# EAGLE design ahe_v1_0 (EAGLE 9.6.2)
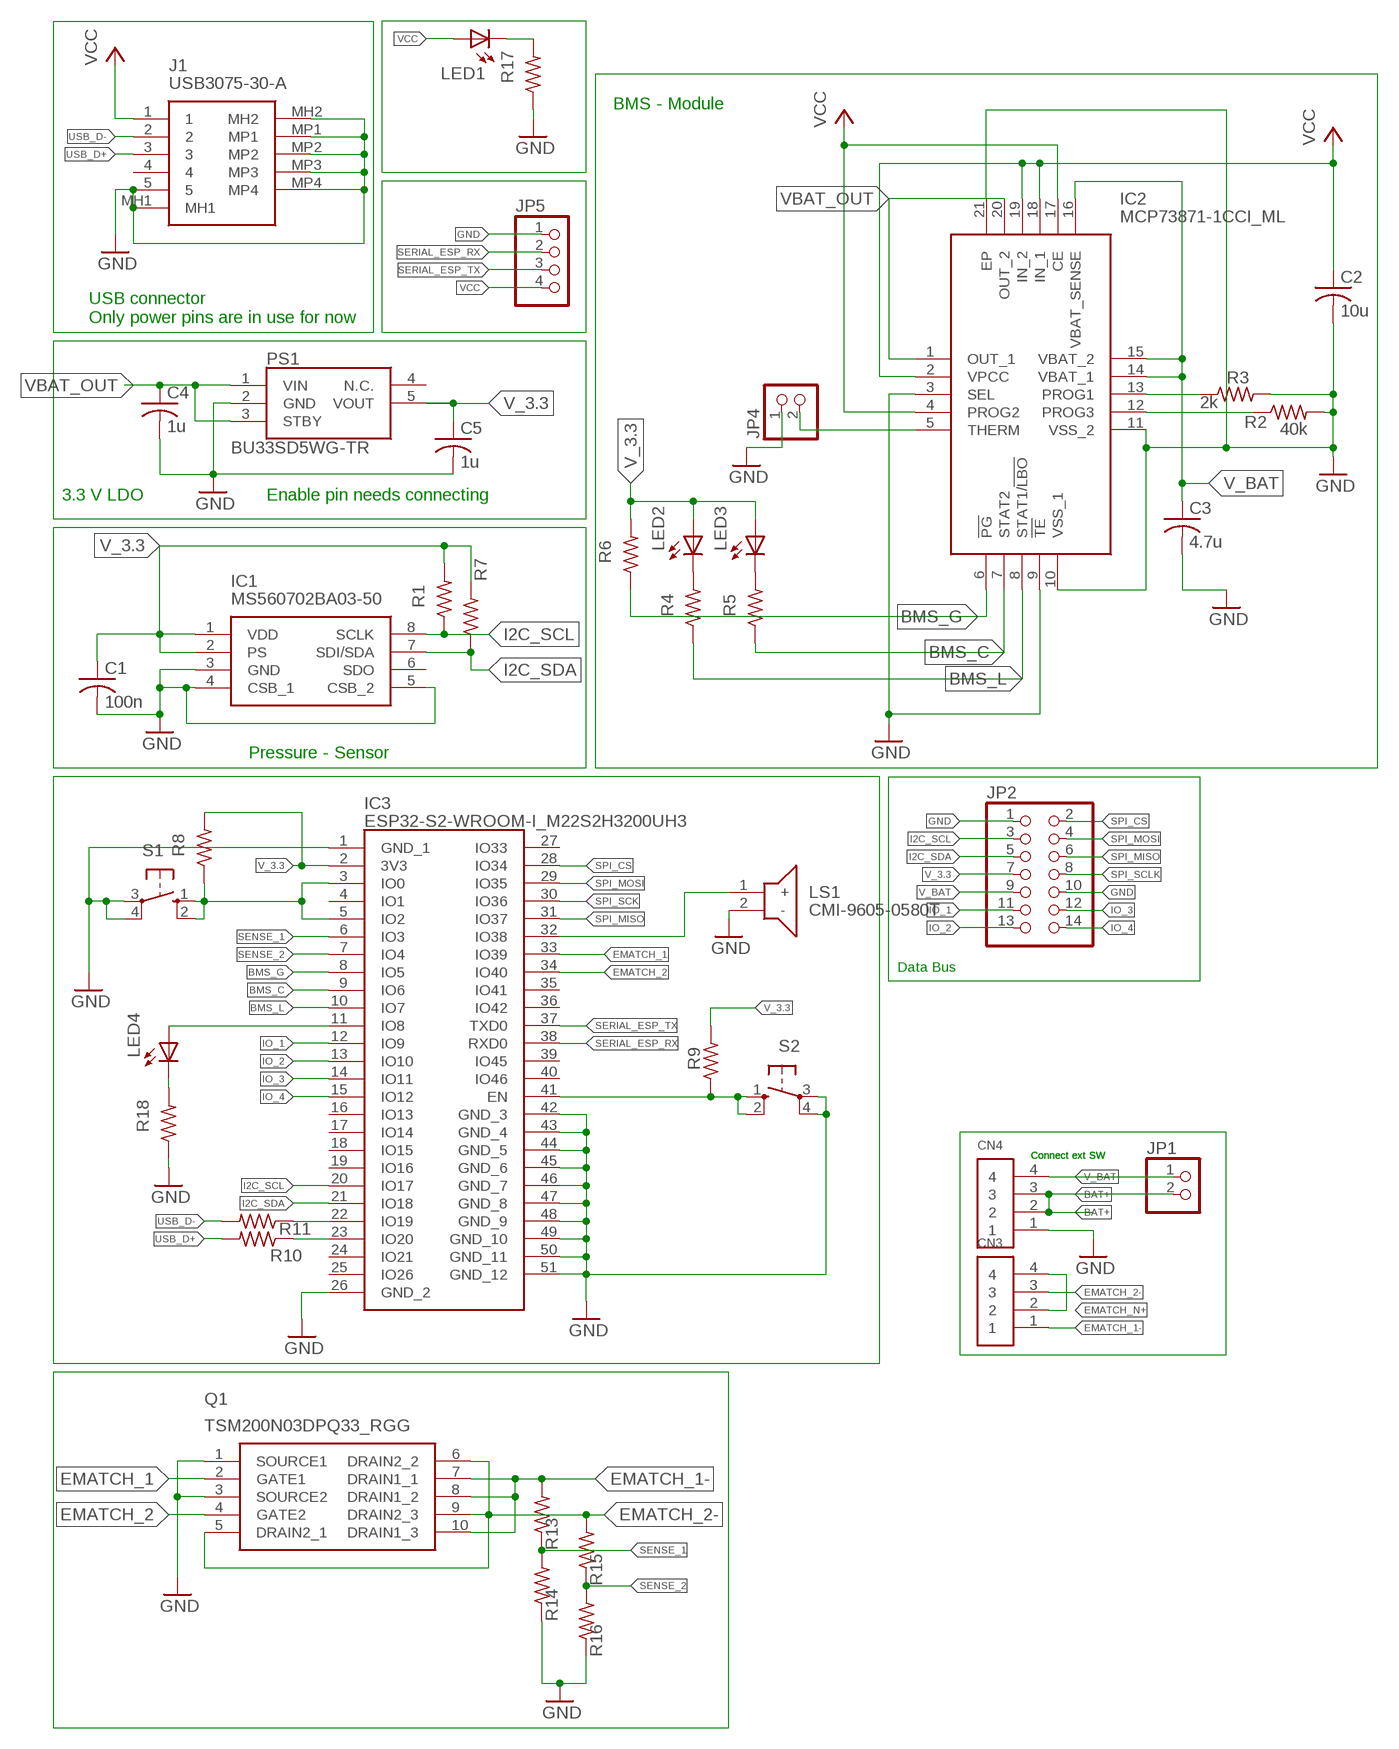
[diagram p0: schematic, sheet 1]

## Parts
C1  100n  C-USC0805  [C0805]
C2  10u  C-USC0805  [C0805]
C3  4.7u  C-USC0805  [C0805]
C4  1u  C-USC0805  [C0805]
C5  1u  C-USC0805  [C0805]
CN3  1X4-3.5MM  [1X04-3.5MM]
CN4  1X4-3.5MM  [1X04-3.5MM]
IC1  MS560702BA03-50  [MS5607-02BA03]
IC2  MCP73871-1CCI_ML  [QFN50P400X400X100-21N]
IC3  ESP32-S2-WROOM-I_M22S2H3200UH3  [ESP32S2WROOMIM22S2H3200UH3Q0]
J1  USB3075-30-A  [USB307530A]
JP1  PINHD-1X2  [1X02]
JP2  PINHD-2X7  [2X07]
JP4  PINHD-1X2  [1X02]
JP5  PINHD-1X4  [1X04]
LED1  LEDCHIPLED_0805  [CHIPLED_0805]
LED2  LEDCHIPLED_0805  [CHIPLED_0805]
LED3  LEDCHIPLED_0805  [CHIPLED_0805]
LED4  LEDCHIPLED_0805  [CHIPLED_0805]
LS1  CMI-9605-0580T  [CMI96050580T]
PS1  BU33SD5WG-TR  [SOT95P280X125-5N]
Q1  TSM200N03DPQ33_RGG  [TSM200N03DPQ33RGG]
R1  10k  R-US_R0805  [R0805]
R2  40k  R-US_R0805  [R0805]
R3  2k  R-US_R0805  [R0805]
R4  330  R-US_R0805  [R0805]
R5  330  R-US_R0805  [R0805]
R6  10k  R-US_R0805  [R0805]
R7  10k  R-US_R0805  [R0805]
R8  10k  R-US_R0805  [R0805]
R9  10k  R-US_R0805  [R0805]
R10  33  R-US_R0805  [R0805]
R11  33  R-US_R0805  [R0805]
R13  100k  R-US_R0805  [R0805]
R14  27k  R-US_R0805  [R0805]
R15  100k  R-US_R0805  [R0805]
R16  27k  R-US_R0805  [R0805]
R17  330  R-US_R0805  [R0805]
R18  330  R-US_R0805  [R0805]
S1  10-XX  [B3F-10XX]
S2  10-XX  [B3F-10XX]

## Nets
BAT+ [PWR]: CN4.2 CN4.3 JP1.2
BMS_C: IC2.7(STAT2) IC3.9(IO6) R5.1
BMS_G: IC2.6(!PG) IC3.8(IO5) R6.1
BMS_L: IC2.8(STAT1/!LBO) IC3.10(IO7) R4.1
EMATCH_1: IC3.33(IO39) Q1.2(GATE1)
EMATCH_1- [PWR]: CN3.1 Q1.7(DRAIN1_1) Q1.8(DRAIN1_2) Q1.10(DRAIN1_3) R13.2
EMATCH_2: IC3.34(IO40) Q1.4(GATE2)
EMATCH_2- [V_bat]: CN3.3 Q1.5(DRAIN2_1) Q1.6(DRAIN2_2) Q1.9(DRAIN2_3) R15.2
EMATCH_N+ [PWR]: CN3.2 CN3.4
GND [V_bat]: C1.2 C2.2 C3.2 C4.2 C5.2 CN4.1 IC1.3(GND) IC1.4(CSB_1) IC1.5(CSB_2) IC2.3(SEL) IC2.9(!TE) IC2.10(VSS_1) IC2.11(VSS_2) IC2.21(EP) IC3.1(GND_1) IC3.26(GND_2) IC3.42(GND_3) IC3.43(GND_4) IC3.44(GND_5) IC3.45(GND_6) IC3.46(GND_7) IC3.47(GND_8) IC3.48(GND_9) IC3.49(GND_10) IC3.50(GND_11) IC3.51(GND_12) J1.5 J1.MH1 J1.MH2 J1.MP1 J1.MP2 J1.MP3 J1.MP4 JP2.1 JP2.10 JP4.1 JP5.1 LS1.2(-) PS1.2(GND) Q1.1(SOURCE1) Q1.3(SOURCE2) R2.2 R3.2 R14.1 R16.1 R17.1 R18.1 S1.3(P) S1.4(P1) S2.3(P) S2.4(P1)
I2C_SCL: IC1.8(SCLK) IC3.20(IO17) JP2.3 R1.1
I2C_SDA: IC1.7(SDI/SDA) IC3.21(IO18) JP2.5 R7.1
IO_1: IC3.12(IO9) JP2.11
IO_2: IC3.13(IO10) JP2.13
IO_3: IC3.14(IO11) JP2.12
IO_4: IC3.15(IO12) JP2.14
N$1: IC2.13(PROG1) R3.1
N$2: IC2.12(PROG3) R2.1
N$3: IC2.5(THERM) JP4.2
N$10: IC3.3(IO0) IC3.5(IO2) R8.1 S1.1(S) S1.2(S1)
N$14: IC3.22(IO19) R11.1
N$15: IC3.23(IO20) R10.1
N$18: LED1.C R17.2
N$20: LED2.C R4.2
N$21: LED3.C R5.2
N$22: LED4.C R18.2
N$23: IC3.11(IO8) LED4.A
N$24: IC3.41(EN) R9.1 S2.1(S) S2.2(S1)
SENSE_1: IC3.6(IO3) R13.1 R14.2
SENSE_2: IC3.7(IO4) R15.1 R16.2
SERIAL_ESP_RX: IC3.38(RXD0) JP5.2
SERIAL_ESP_TX: IC3.37(TXD0) JP5.3
SOUND: IC3.32(IO38) LS1.1(+)
SPI_CS: IC3.28(IO34) JP2.2
SPI_MISO: IC3.31(IO37) JP2.6
SPI_MOSI: IC3.29(IO35) JP2.4
SPI_SCK: IC3.30(IO36)
SPI_SCLK: JP2.8
USB_D+: J1.3 R10.2
USB_D-: J1.2 R11.2
V_3.3 [PWR]: C1.1 C5.1 IC1.1(VDD) IC1.2(PS) IC3.2(3V3) JP2.7 LED2.A LED3.A PS1.5(VOUT) R1.2 R6.2 R7.2 R8.2 R9.2
V_BAT [PWR]: C3.1 CN4.4 IC2.14(VBAT_1) IC2.15(VBAT_2) IC2.16(VBAT_SENSE) JP1.1 JP2.9
VBAT_OUT: C4.1 IC2.1(OUT_1) IC2.20(OUT_2) PS1.1(VIN) PS1.3(STBY)
VCC [PWR]: C2.1 IC2.2(VPCC) IC2.4(PROG2) IC2.17(CE) IC2.18(IN_1) IC2.19(IN_2) J1.1 JP5.4 LED1.A
Unconnected: IC1.6(SDO) IC3.4(IO1) IC3.16(IO13) IC3.17(IO14) IC3.18(IO15) IC3.19(IO16) IC3.24(IO21) IC3.25(IO26) IC3.27(IO33) IC3.35(IO41) IC3.36(IO42) IC3.39(IO45) IC3.40(IO46) J1.4 PS1.4(N.C.)

## Notes on the sheet
- BMS - Module
- USB connector
  Only power pins are in use for now
- 3.3 V LDO | Enable pin needs connecting
- Pressure - Sensor
- Data Bus
- Connect ext SW | Connect ext SW | Connect ext SW

## Library data of the parts
C1-C5 = rcl:C-US: CAPACITOR, American symbol; SPICEPREFIX: C
CN3 CN4 = adafruit:1X4: 4-pin connector
IC1 = MS560702BA03-50:MS560702BA03-50: MS560702BA03-50, Barometric Pressure Sensor, 1200mbar 0 3.6 V Output, 8-Pin QFN Source: Datasheet <http://www.te.com/commerce/DocumentDelivery/DDEController?Action=srchrtrv&DocNm=MS5607-02BA03&DocType=Data Sheet&DocLang=English>; DESCRIPTION: MS560702BA03-50, Barometric Pressure Sensor, 1200mbar 0 3.6 V Output, 8-Pin QFN; HEIGHT: mm; MANUFACTURER_NAME: TE Connectivity; MANUFACTURER_PART_NUMBER: MS560702BA03-50; MOUSER_PART_NUMBER: 824-MS560702BA03-50; MOUSER_PRICE-STOCK: https://www.mouser.co.uk/ProductDetail/Measurement-Specialties/MS560702BA03-50?qs=urSpXqmdEVImCZG1H%252BT8ng%3D%3D
IC2 = MCP73871-1CCI_ML:MCP73871-1CCI_ML: Battery Management USB/AC Battery Charger w/Pwr Mgmt Source: Datasheet <https://ww1.microchip.com/downloads/en/DeviceDoc/MCP73871-Data-Sheet-20002090E.pdf>; DESCRIPTION: Battery Management USB/AC Battery Charger w/Pwr Mgmt; HEIGHT: 1mm; MANUFACTURER_NAME: Microchip; MANUFACTURER_PART_NUMBER: MCP73871-1CCI/ML; MOUSER_PART_NUMBER: 579-MCP73871-1CCI/ML; MOUSER_PRICE-STOCK: https://www.mouser.co.uk/ProductDetail/Microchip-Technology-Atmel/MCP73871-1CCI-ML?qs=wd5RIQLrsJhV5aSUuJa0zQ%3D%3D
IC3 = ESP32-S2-WROOM-I_M22S2H3200UH3:ESP32-S2-WROOM-I_M22S2H3200UH3: WiFi Modules (802.11) Module ESP32-S2 WROOM IPEX ANT Source: Datasheet <https://www.espressif.com/sites/default/files/documentation/esp32-s2-wroom_esp32-s2-wroom-i_datasheet_en.pdf>; DESCRIPTION: WiFi Modules (802.11) Module ESP32-S2 WROOM IPEX ANT; HEIGHT: 3.45mm; MANUFACTURER_NAME: Espressif Systems; MANUFACTURER_PART_NUMBER: ESP32-S2-WROOM-I(M22S2H3200UH3Q0); MOUSER_PART_NUMBER: 356-ESP32S2WRMI320UH; MOUSER_PRICE-STOCK: https://www.mouser.co.uk/ProductDetail/Espressif-Systems/ESP32-S2-WROOM-IM22S2H3200UH3Q0?qs=vHuUswq2%252BswK%2FNdFP9puyg%3D%3D
J1 = USB3075-30-A:USB3075-30-A: GCT (GLOBAL CONNECTOR TECHNOLOGY) - USB3075-30-A - USB Connector, Micro USB Type B, USB 2.0, Receptacle, 5 Ways, Surface Mount, Right Angle Source: Datasheet <https://componentsearchengine.com/Datasheets/2/USB3075-30-A.pdf>; DESCRIPTION: GCT (GLOBAL CONNECTOR TECHNOLOGY) - USB3075-30-A - USB Connector, Micro USB Type B, USB 2.0, Receptacle, 5 Ways, Surface Mount, Right Angle; HEIGHT: 2.7mm; MANUFACTURER_NAME: GCT (GLOBAL CONNECTOR TECHNOLOGY); MANUFACTURER_PART_NUMBER: USB3075-30-A; MOUSER_PART_NUMBER: 640-USB3075-30-A; MOUSER_PRICE-STOCK: https://www.mouser.co.uk/ProductDetail/GCT/USB3075-30-A?qs=KUoIvG%2F9IlbGMJplbp1ybA%3D%3D
JP1 JP4 = pinhead:PINHD-1X2: PIN HEADER
JP2 = pinhead:PINHD-2X7: PIN HEADER
JP5 = pinhead:PINHD-1X4: PIN HEADER
LED1-LED4 = adafruit:LED: LED OSRAM: - CHIPLED LG R971, LG N971, LY N971, LG Q971, LY Q971, LO R971, LY R971 LH N974, LH R974 LS Q976, LO Q976, LY Q976 LO Q996 - Hyper CHIPLED LW Q18S LB Q993, LB Q99A, LB R99A - SideLED LS A670, LO A670, LY A670, LG A670, LP A670 LB A673, LV A673, LT A673, LW A673 LH A674 LY A675 LS A676, LA A676, LO A676, LY A676, LW A676 LS A679, LY A679, LG A679 - Hyper Micro SIDELED® LS Y876, LA Y876, LO Y876, LY Y876 LT Y87S - SmartLED LW L88C, LW L88S LB L89C, LB L89S, LG L890 LS L89K, LO L89K, LY L89K LS L896, LA L896, LO L896, LY L896 - TOPLED LS T670, LO T670, LY T670, LG T670, LP T670 LSG T670, LSP T670, LSY T670, LOP T670, LYG T670 LG T671, LOG T671, LSG T671 LB T673, LV T673, LT T673, LW T673 LH T674 LS T676, LA T676, LO T676, LY T676, LB T676, LH T676, LSB T676, LW T676 LB T67C, LV T67C, LT T67C, LS T67K, LO T67K, LY T67K, LW E67C LS E67B, LA E67B, LO E67B, LY E67B, LB E67C, LV E67C, LT E67C LW T67C LS T679, LY T679, LG T679 LS T770, LO T770, LY T770, LG T770, LP T770 LB T773, LV T773, LT T773, LW T773 LH T774 LS E675, LA E675, LY E675, LS T675 LS T776, LA T776, LO T776, LY T776, LB T776 LHGB T686 LT T68C, LB T68C - Hyper Mini TOPLED® LB M676 - Mini TOPLED Santana® LG M470 LS M47K, LO M47K, LY M47K Source: http://www.osram.convergy.de/
LS1 = CMI-9605-0580T:CMI-9605-0580T: Piezo Buzzers & Audio Indicators buzzer, 9.6 mm x 5 mm deep, M, 5 VDC, 80 dB, Through Hole, Audio Indicator Source: Datasheet <https://componentsearchengine.com/Datasheets/1/CMI-9605-0580T.pdf>; DESCRIPTION: Piezo Buzzers & Audio Indicators buzzer, 9.6 mm x 5 mm deep, M, 5 VDC, 80 dB, Through Hole, Audio Indicator; HEIGHT: 5mm; MANUFACTURER_NAME: CUI Inc.; MANUFACTURER_PART_NUMBER: CMI-9605-0580T; MOUSER_PART_NUMBER: 490-CMI-9605-0580T; MOUSER_PRICE-STOCK: https://www.mouser.co.uk/ProductDetail/CUI-Devices/CMI-9605-0580T?qs=P1JMDcb91o49u9Yh70m6sw%3D%3D
PS1 = BU33SD5WG-TR:BU33SD5WG-TR: LDO regulator,3.3V,0.5A,standby,SSOP5 ROHM BU33SD5WG-TR, LDO Voltage Regulator, 0.5A, 3.3 V +/-2%, 1.7 6 Vin, 5-Pin SSOP Source: Datasheet <https://componentsearchengine.com/Datasheets/1/BU33SD5WG-TR.pdf>; DESCRIPTION: LDO regulator,3.3V,0.5A,standby,SSOP5 ROHM BU33SD5WG-TR, LDO Voltage Regulator, 0.5A, 3.3 V +/-2%, 1.7 6 Vin, 5-Pin SSOP; HEIGHT: 1.25mm; MANUFACTURER_NAME: ROHM Semiconductor; MANUFACTURER_PART_NUMBER: BU33SD5WG-TR; MOUSER_PART_NUMBER: 755-BU33SD5WG-TR; MOUSER_PRICE-STOCK: https://www.mouser.co.uk/ProductDetail/ROHM-Semiconductor/BU33SD5WG-TR?qs=%2FKR40Cd6GUrQDzRkUEt69Q%3D%3D
Q1 = TSM200N03DPQ33_RGG:TSM200N03DPQ33_RGG: MOSFET MOSFET, Dual, N-Ch Trench, 30V, 20A Source: Datasheet <https://www.taiwansemi.com/products/datasheet/TSM200N03D_B1710.pdf>; DESCRIPTION: MOSFET MOSFET, Dual, N-Ch Trench, 30V, 20A; HEIGHT: 0.8mm; MANUFACTURER_NAME: Taiwan Semiconductor; MANUFACTURER_PART_NUMBER: TSM200N03DPQ33 RGG; MOUSER_PART_NUMBER: 821-TSM200N03DPQ33RG; MOUSER_PRICE-STOCK: https://www.mouser.co.uk/ProductDetail/Taiwan-Semiconductor/TSM200N03DPQ33-RGG?qs=BZBei1rCqCAHGBwVoEKNiA%3D%3D
R1-R11 R13-R18 = rcl:R-US_: RESISTOR, American symbol; SPICEPREFIX: R
S1 S2 = switch-omron:10-XX: OMRON SWITCH; MPN: B3F-1000; OC_FARNELL: 176432; OC_NEWARK: 36M3542

## Net classes
0 default: width 0.178 mm, clearance 0.152 mm
1 PWR: width 0.254 mm, clearance 0.152 mm
2 V_bat: width 0.305 mm, clearance 0.152 mm

## Board
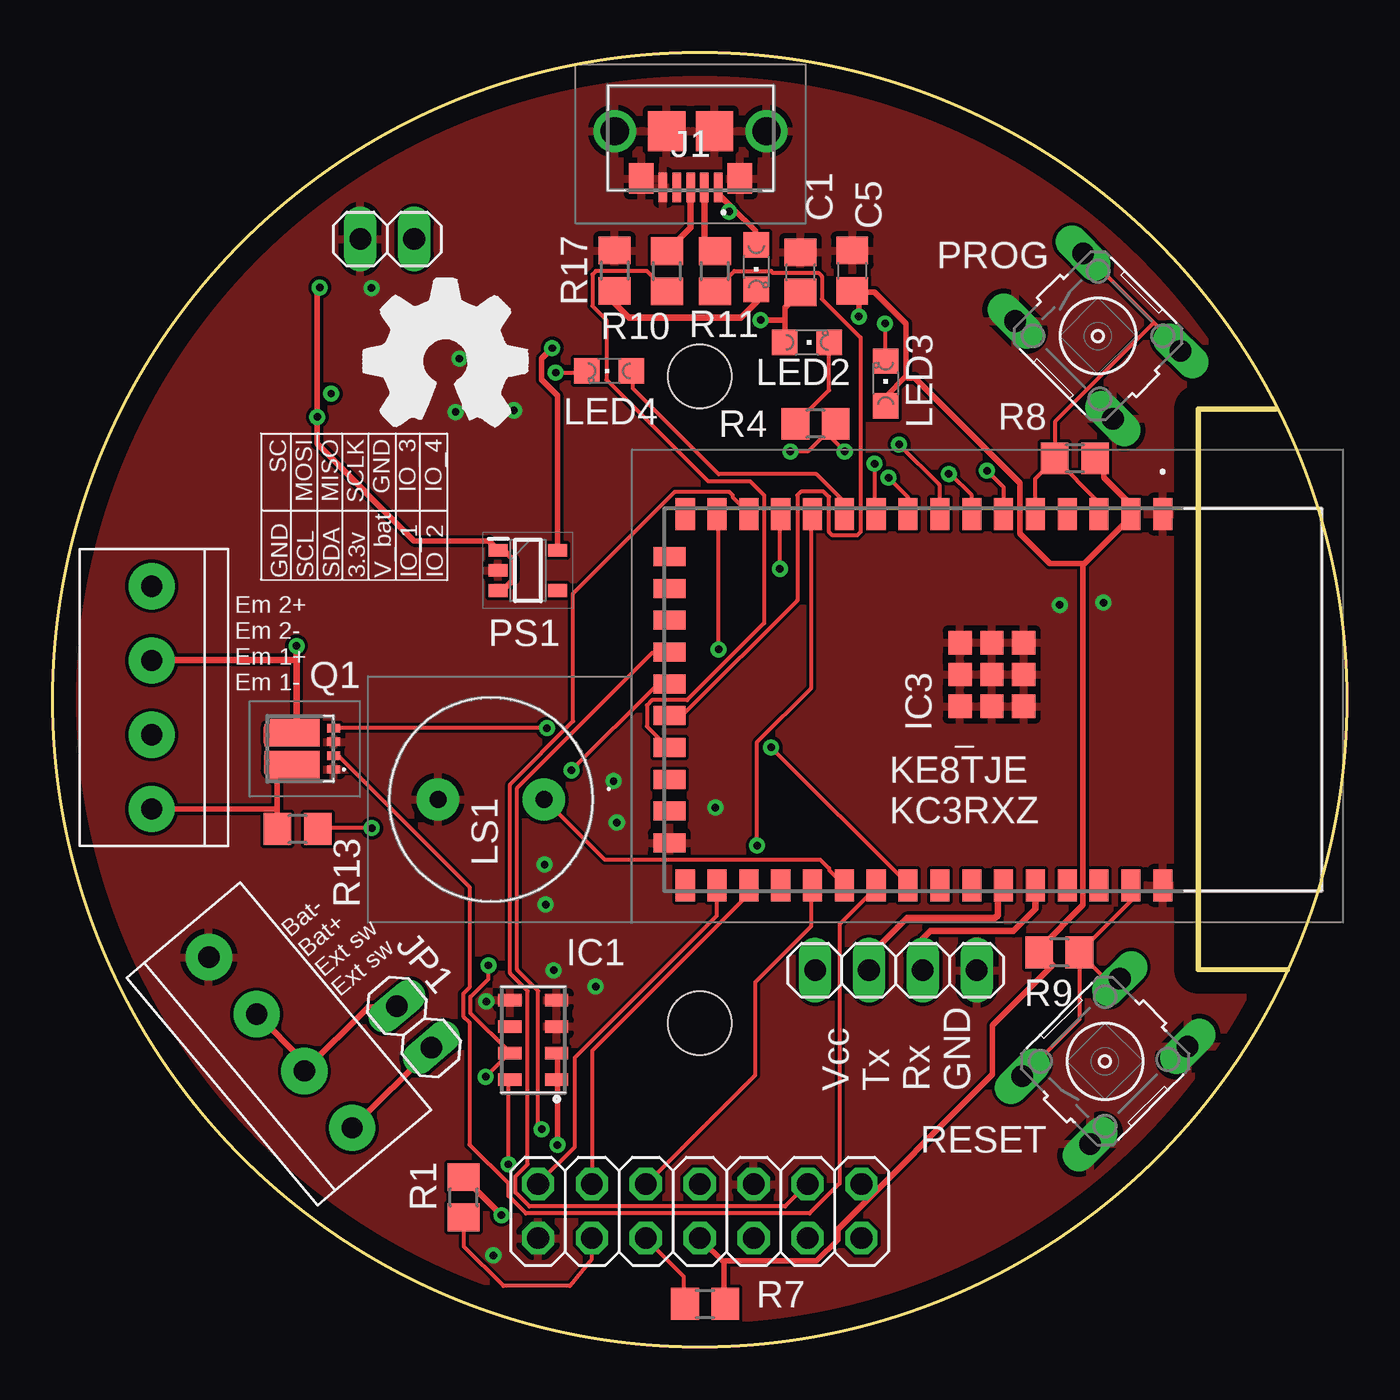
[diagram p1: board, top side]
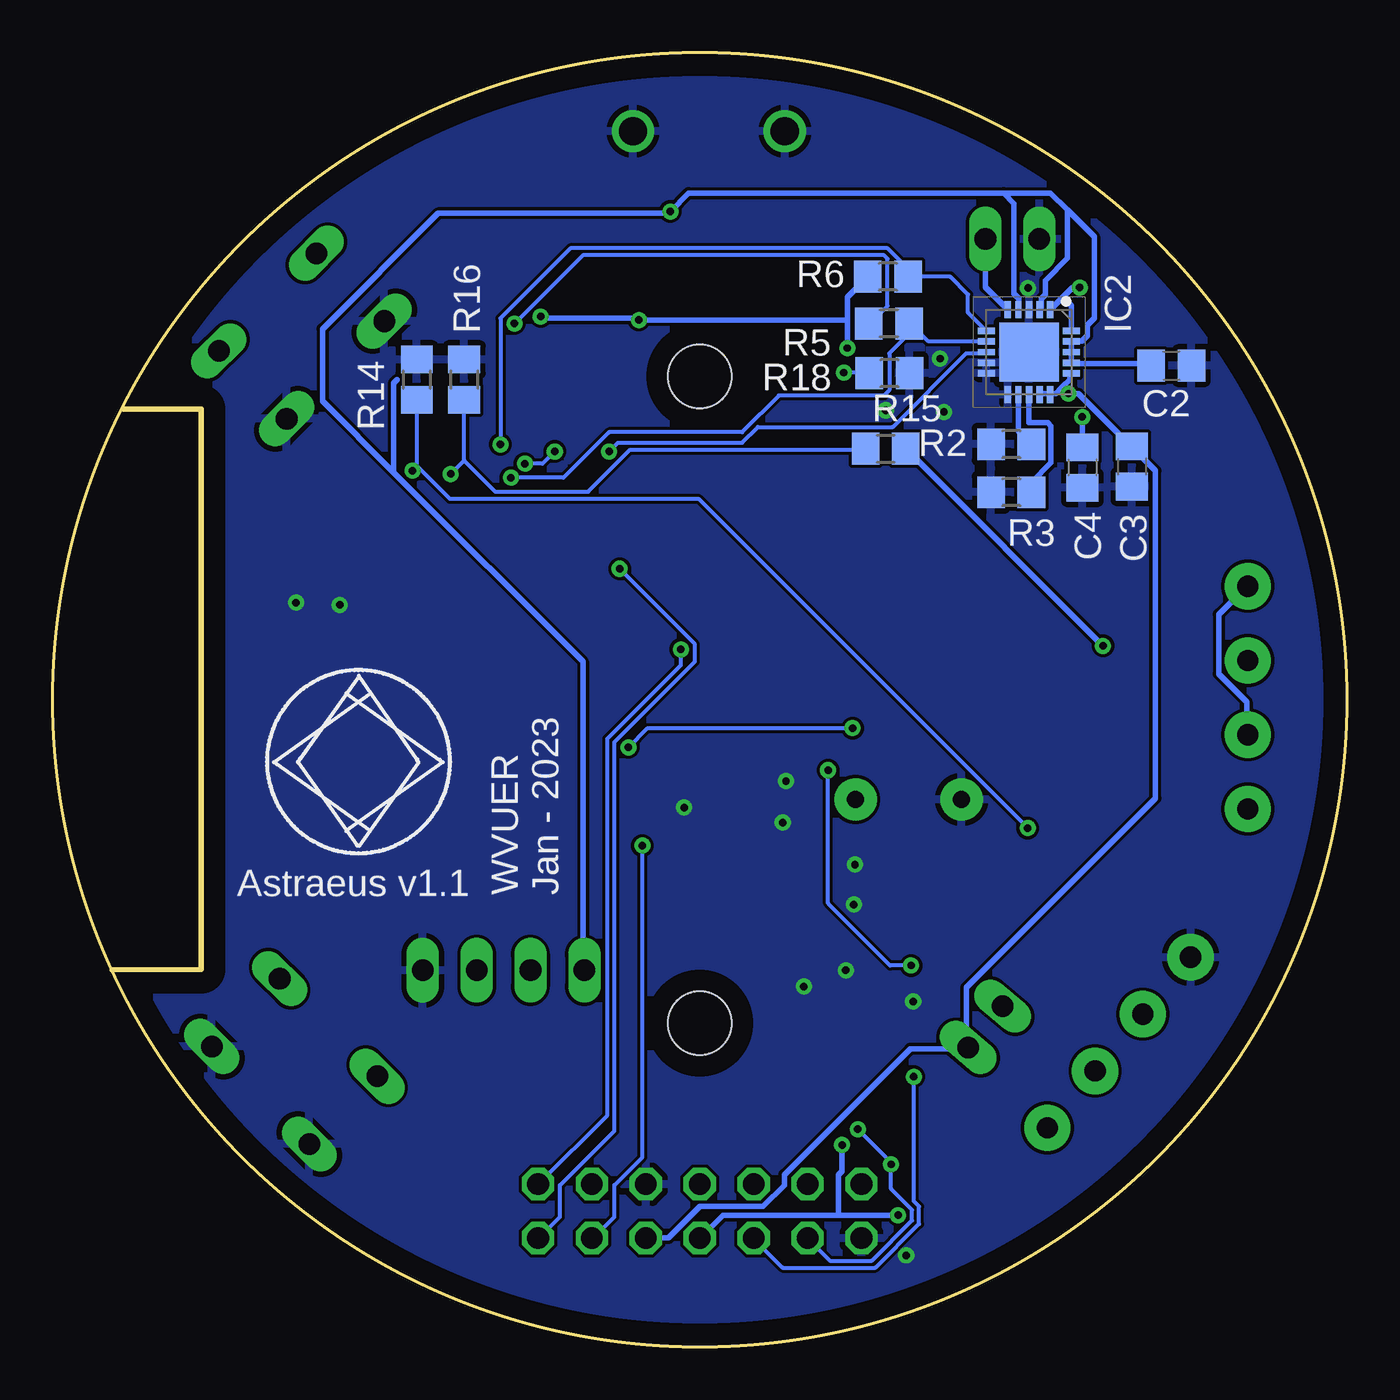
[diagram p2: board, bottom side, seen from below]

Size 60.96 x 60.96 mm. Coordinates in mm from the lower left corner, seen from the top.
Outline: 57.62,44.17 53.99,44.17 53.99,17.78 58.17,17.74
Outline: circle at 30.48,30.48 radius 30.48
Copper layers (1*16): Top 0.035mm / dielectric 1.5mm / Bottom 0.035mm
Design rules "default": minimum track width 6mil, minimum drill 0.35mm, track to track 6mil, track to pad 6mil, pad to pad 6mil, via to via 6mil, smd to smd 6mil, copper to edge 40mil, drill to drill 6mil, minimum pad ring 10mil, minimum via ring 8mil, stop-mask expansion 4mil, vias tented up to drill 0mil, thermal gap 10mil
Holes 3 mm at 30.48,15.24 30.48,45.72

### Footprints (pad centres in the part's own frame; a part is rotated, then mirrored left to right if it is on the bottom)
C0805 = smd 1.3 x 1.5: 1 -0.95,0; 2 0.95,0
1X04-3.5MM = drill 1 pad 2.184: 1 -5.25,0; 2 -1.75,0; 3 1.75,0; 4 5.25,0
MS5607-02BA03 = smd 1.1 x 0.6: 1 -1.1,1.875; 2 -1.1,0.625; 3 -1.1,-0.625; 4 -1.1,-1.875; 5 1.1,-1.875; 6 1.1,-0.625; 7 1.1,0.625; 8 1.1,1.875
QFN50P400X400X100-21N = smd 0.8 x 0.3: 1 -2,1; 2 -2,0.5; 3 -2,0; 4 -2,-0.5; 5 -2,-1; 11 2,-1; 12 2,-0.5; 13 2,0; 14 2,0.5; 15 2,1 | smd 0.3 x 0.8: 6 -1,-2; 7 -0.5,-2; 8 0,-2; 9 0.5,-2; 10 1,-2; 16 1,2; 17 0.5,2; 18 0,2; 19 -0.5,2; 20 -1,2 | smd 2.8 x 2.8: 21 0,0
ESP32S2WROOMIM22S2H3200UH3Q0 = smd 1.5 x 0.9: 1 -8.75,8; 2 -8.75,6.5; 3 -8.75,5; 4 -8.75,3.5; 5 -8.75,2; 6 -8.75,0.5; 7 -8.75,-1; 8 -8.75,-2.5; 9 -8.75,-4; 10 -8.75,-5.5; 11 -8.75,-7; 12 -8.75,-8.5; 13 -8.75,-10; 14 -8.75,-11.5; 15 -8.75,-13; 16 -8.75,-14.5; 27 8.75,-14.5; 28 8.75,-13; 29 8.75,-11.5; 30 8.75,-10; 31 8.75,-8.5; 32 8.75,-7; 33 8.75,-5.5; 34 8.75,-4; 35 8.75,-2.5; 36 8.75,-1; 37 8.75,0.5; 38 8.75,2; 39 8.75,3.5; 40 8.75,5; 41 8.75,6.5; 42 8.75,8 | smd 0.9 x 1.5: 17 -6.75,-15.25; 18 -5.25,-15.25; 19 -3.75,-15.25; 20 -2.25,-15.25; 21 -0.75,-15.25; 22 0.75,-15.25; 23 2.25,-15.25; 24 3.75,-15.25; 25 5.25,-15.25; 26 6.75,-15.25 | smd 1.1 x 1.1: 43 -1.19,-0.05; 44 -1.19,-1.55; 45 0.31,-1.55; 46 0.31,-0.05; 47 0.31,1.45; 48 -1.19,1.45; 49 -2.69,1.45; 50 -2.69,-0.05; 51 -2.69,-1.55
USB307530A = smd 0.4 x 1.4: 1 -1.3,2.65; 2 -0.65,2.65; 3 0,2.65; 4 0.65,2.65; 5 1.3,2.65 | drill 1.329 pad 1.85: MH1 -3.575,0; MH2 3.575,0 | smd 1.75 x 1.9: MP1 -1.125,0; MP2 1.125,0 | smd 1.15 x 1.45: MP3 -2.32,2.23; MP4 2.32,2.23
1X02 = drill 1.016 long: 1 -1.27,0; 2 1.27,0
2X07 = drill 1.016 octagon: 1 -7.62,-1.27; 2 -7.62,1.27; 3 -5.08,-1.27; 4 -5.08,1.27; 5 -2.54,-1.27; 6 -2.54,1.27; 7 0,-1.27; 8 0,1.27; 9 2.54,-1.27; 10 2.54,1.27; 11 5.08,-1.27; 12 5.08,1.27; 13 7.62,-1.27; 14 7.62,1.27
1X04 = drill 1.016 long: 1 -3.81,0; 2 -1.27,0; 3 1.27,0; 4 3.81,0
CHIPLED_0805 = smd 1.2 x 1.2: A 0,-1.05; C 0,1.05
CMI96050580T = drill 0.8 pad 2: 1 0,0; 2 0,-5
SOT95P280X125-5N = smd 0.9 x 0.6: 1 -1.4,0.95; 2 -1.4,0; 3 -1.4,-0.95; 4 1.4,-0.95; 5 1.4,0.95
TSM200N03DPQ33RGG = smd 0.4 x 0.6: 1 -0.975,-1.563; 2 -0.325,-1.563; 3 0.325,-1.563; 4 0.975,-1.563 | smd 0.4 x 0.25: 5 0.975,1.563; 6 0.31,1.563; 7 -0.31,1.563; 8 -0.975,1.563 | smd 1.29 x 2.35: 9 0.755,0.262; 10 -0.755,0.262
R0805 = smd 1.3 x 1.5: 1 -0.95,0; 2 0.95,0
B3F-10XX = drill 1.016 long: 1 -3.251,2.261; 2 3.251,2.261; 3 -3.251,-2.261; 4 3.251,-2.261

### Placement (x,y rotation side)
C1  35.23,50.62 90 top
C2  8.26,46.23 0 bottom
C3  10.11,41.48 270 bottom
C4  12.45,41.43 270 bottom
C5  37.67,50.7 90 top
CN3  4.65,30.58 90 top
CN4  10.72,14.33 310 top
IC1  22.63,14.45 180 top
IC2  14.96,46.86 270 bottom
IC3  44.3,30.48 270 top
J1  30.05,57.28 180 top
JP1  17.02,15.06 130 top
JP2  30.48,6.38 0 top
JP4  15.75,52.2 0 top
JP5  39.73,17.73 180 top
LED1  33.15,50.88 180 top
LED2  35.53,47.32 270 top
LED3  39.24,45.39 0 top
LED4  26.21,45.97 90 top
LS1  23.14,25.78 270 top
PS1  22.38,36.58 0 top
Q1  11.66,28.17 90 top
R1  19.35,7.04 90 top
R2  15.8,42.52 180 bottom
R3  15.8,40.26 180 bottom
R4  35.94,43.48 180 top
R5  21.56,48.21 180 bottom
R6  21.62,50.42 180 bottom
R7  30.73,2.01 0 top
R8  48.16,41.86 0 top
R9  47.42,18.57 180 top
R10  28.93,50.67 90 top
R11  31.19,50.67 90 top
R13  11.53,24.38 180 top
R14  43.81,45.57 270 bottom
R15  21.72,42.32 0 bottom
R16  41.58,45.57 270 bottom
R17  26.47,50.7 270 top
R18  21.54,45.87 180 bottom
S1  49.25,47.62 315 top
S2  49.58,13.44 45 top

### Tracks (layer width: path | path; a pad name or v marks a point on that pad's centre or on a via)
BAT+
  Top 0.254: 14.87,16.02 14.86,16.02 | 9.66,15.6 CN4.2 11.84,13.42 CN4.3 14.87,16.02 | JP1.2 16.18,16.02 14.87,16.02
BMS_C  (via drill 0.35)
  Top 0.178: v39.38,40.95 40.28,40.04 40.28,39.29 IC3.9
  Bottom 0.178: IC2.7 17,47.38 19.73,47.38 20.55,48.21 R5.1 20.39,47.96 21.55,46.81 21.55,45.07 21.79,44.83 26.75,44.83 28.48,43.09 34.75,43.09 36.9,40.95 v39.38,40.95
BMS_G  (via drill 0.35)
  Top 0.178: v39.87,42.51 41.77,40.62 41.77,39.29 IC3.8
  Bottom 0.178: v39.87,42.51 39.87,48.46 36.57,51.76 21.63,51.76 20.72,50.85 20.72,50.44 R6.1
  Bottom 0.2: IC2.6 17.83,48.73 17.83,49.58 18.67,50.42 R6.1
BMS_L  (via drill 0.35)
  Top 0.178: v34.75,42.18 35.58,42.18 36.82,43.42 R4.1 36.49,43.01 v37.31,42.18 | v38.72,41.6 38.72,39.29 IC3.10
  Bottom 0.178: v34.75,42.18 34.34,42.6 28.48,42.6 27.74,43.34 21.38,43.34 17.91,46.81 17,46.81 IC2.8 | v38.72,41.6 37.89,41.6 v37.31,42.18
EMATCH_1
  Top 0.178: 19.63,21.65 13.46,27.82 13.29,27.82 Q1.2 | 19.63,9.51 21.46,7.68 21.46,7.1 22.29,6.27 35.66,6.27 37.06,7.68 37.06,19.89 38.72,21.55 38.72,21.71 IC3.33
  Top 0.2: 19.63,21.65 19.63,16.92 19.34,16.63 19.34,15.56 19.63,15.27 19.63,9.51
EMATCH_1-
  Top 0.254: 10.07,27.49 10.07,27.82 Q1.7 | 10.07,27.49 10.07,27.24 Q1.8 10.07,27.08 10.57,26.58 10.57,25.34 | 10.07,27.49 11.39,27.49 Q1.10 | 10.57,25.34 10.57,24.43 R13.2 | 10.57,25.34 4.71,25.34 CN3.1
EMATCH_2  (via drill 0.35)
  Top 0.178: v23.28,29.14 13.29,29.14 Q1.4 | v33.85,28.23 40.28,21.79 IC3.34
  Bottom 0.178: v23.28,29.14 32.94,29.14 v33.85,28.23
EMATCH_2-  (via drill 0.35)
  Top 0.305: 10.07,28.89 10.07,29.14 Q1.5 | 10.07,28.89 10.07,28.48 Q1.6 | 10.07,28.89 11.39,28.89 Q1.9 11.47,29.06 11.47,32.36 | 11.47,32.36 v11.47,33.02 | 11.47,32.36 4.71,32.36 CN3.3
  Bottom 0.305: v11.47,33.02 20.72,42.27 R15.2
EMATCH_N+
  Bottom 0.254: CN3.2 4.71,28.89 4.71,30.38 6.03,31.7 6.03,34.51 4.71,35.83 CN3.4
GND  (via drill 0.35)
  other vias: 47.45,34.95 49.5,35.05 23.22,20.83 23.16,22.71 26.57,24.69 26.42,26.64 31.22,25.4 23.6,17.73 25.58,16.97 20.75,4.29 20.42,16.26 19.15,46.56 18.97,44.04 21.72,44.12 15.01,49.89
  pour Top: -1.52,66.55 -1.52,-2.54 71.88,-2.54 71.88,66.55
  pour Bottom: -3.81,83.31 -3.81,-5.33 75.39,-5.33 75.39,83.31
I2C_SCL  (via drill 0.35)
  Top 0.178: v21.46,8.59 21.46,12.55 IC1.8 | R1.1 19.36,4.72 21.23,2.85 24.36,2.85 25.4,4.12 JP2.3 | v23.03,10.24 22.87,10.4 22.87,16.76 21.88,17.75 21.88,26.33 28.23,32.69 28.98,32.69 IC3.20
  Bottom 0.178: JP2.3 25.34,5.04 24.35,4.04 22.37,4.04 20.47,5.94 20.47,6.44 21.46,7.43 v21.46,8.59 21.46,8.67 v23.03,10.24
I2C_SDA  (via drill 0.35)
  Top 0.178: v20.39,12.71 21.46,13.79 IC1.7 21.53,13.85 19.68,15.7 19.68,16.48 20.52,17.32 v20.52,17.96 | v24.43,27.16 28.48,31.2 28.98,31.2 IC3.21 | R7.1 29.72,2.06 29.72,3.3 27.98,5.04 JP2.5
  Bottom 0.178: v20.39,12.71 20.39,6.85 20.14,6.6 20.14,5.78 22.21,3.71 26.58,3.71 27.9,5.04 JP2.5 | v24.43,27.16 24.43,20.89 21.51,17.96 v20.52,17.96
IO_1  (via drill 0.35)
  Top 0.178: v33.19,23.61 33.19,28.48 35.74,31.04 35.74,39.21 IC3.12
  Bottom 0.178: v33.19,23.61 33.19,8.91 34.51,7.59 34.51,6.11 35.5,5.12 JP2.11
IO_2  (via drill 0.35)
  Top 0.178: v34.26,36.65 34.26,39.21 IC3.13
  Bottom 0.178: v34.26,36.65 30.71,33.1 30.71,32.28 34.51,28.48 34.51,10.15 37.06,7.59 37.06,6.11 38.06,5.12 JP2.13
IO_3
  Top 0.178: IC3.14 32.77,39.29 32.03,40.04 32.03,40.12 31.86,40.28 29.3,40.28 24.52,35.5 24.52,29.47 21.55,26.5 21.55,17.58 22.37,16.76 22.37,8.59 21.79,8.01 21.79,7.26 22.45,6.6 34.51,6.6 35.5,7.59 JP2.12
IO_4  (via drill 0.35)
  Top 0.178: v31.37,32.85 31.37,39.21 IC3.15
  Bottom 0.178: v31.37,32.85 31.37,32.11 34.84,28.64 34.84,10.9 38.06,7.68 JP2.14
N$1
  Bottom 0.254: IC2.13 14.96,43.55 14.08,43.55 13.92,43.38 13.92,41.65 14.85,40.72 R3.1
N$2
  Bottom 0.254: R2.1 15.46,43.13 IC2.12
N$3
  Bottom 0.254: IC2.5 17.02,49.92 JP4.2
N$10
  Top 0.178: 51.88,48.25 53.16,46.97 S1.2 | 51.88,48.25 48.62,51.51 S1.1 | 51.88,48.25 47.22,43.59 47.22,41.94 R8.1
  Top 0.2: IC3.5 46.3,40.9 47.21,41.81 R8.1 49.3,39.77 IC3.3
N$14
  Top 0.178: IC3.22 29.06,29.8 29.72,29.8 35.08,35.17 35.08,40.12 35.25,40.28 36.32,40.28 36.57,40.04 36.57,38.39 36.73,38.22 37.89,38.22 38.06,38.39 38.06,47.55 36.24,49.37 36.24,50.44 36.07,50.6 33.93,50.6 33.85,50.69 32.11,50.69 31.2,49.78 R11.1
N$15
  Top 0.178: IC3.23 28.98,28.23 27.98,29.22 27.98,30.21 28.23,30.46 29.88,30.46 33.52,34.09 33.52,40.12 32.85,40.78 30.87,40.78 26.09,45.57 26.09,48.37 25.43,49.03 25.43,50.52 25.59,50.69 27.98,50.69 28.89,49.78 R10.1
N$18
  Top 0.305: R17.2 26.47,49.16 27.14,48.49 32.42,48.49 33.15,49.22 LED1.C
N$20
  Top 0.178: LED2.C 36.57,47.3 36.57,45.07 35,43.5 R4.2
N$21  (via drill 0.35)
  Top 0.178: v39.21,48.21 39.21,46.48 LED3.C
  Bottom 0.178: v39.21,48.21 35.99,51.43 21.79,51.43 21.63,51.26 21.63,49.03 22.45,48.21 R5.2
N$22  (via drill 0.35)
  Top 0.178: v23.69,45.9 25.09,45.9 LED4.C
  Bottom 0.178: v23.69,45.9 22.54,45.9 R18.2
N$23
  Top 0.178: LED4.A 27.32,45.9 27.32,45.16 31.37,41.11 35.99,41.11 37.23,39.87 37.23,39.29 IC3.11
N$24
  Top 0.178: 50.8,20.99 50.8,21.46
  Top 0.2: IC3.41 50.8,20.99 R9.1 | R9.1 48.37,15.43 S2.1 | R9.1 49.6,17.33 S2.2
  Top 0.305: IC3.41 50.8,21.46
SENSE_1  (via drill 0.35)
  Top 0.178: v15.02,24.43 12.55,24.43 R13.1
  Top 0.2: v44.02,41.27 44.8,40.5 IC3.6
  Bottom 0.178: v15.02,24.43 30.54,39.95 42.27,39.95 43.75,41.44 v44.02,41.27
  Bottom 0.2: R14.2 43.81,41.48 v44.02,41.27
SENSE_2  (via drill 0.35)
  Top 0.2: IC3.7 43.3,40.12 42.29,41.12 v42.22,41.12
  Bottom 0.178: R15.1 22.7,42.27 33.76,42.27 35.74,40.28 40.12,40.28 41.52,41.69 41.58,41.76
  Bottom 0.2: v42.22,41.12 41.58,41.76 R16.2
SERIAL_ESP_RX
  Top 0.305: IC3.38 46.3,20.62 45.26,19.58 41.35,19.58 41,19.23 JP5.2
SERIAL_ESP_TX
  Top 0.305: IC3.37 44.53,21.46 44.53,20.32 44.4,20.19 40.23,20.19 38.46,18.41 JP5.3
SOUND
  Top 0.178: IC3.32 37.23,21.79 36.57,22.45 36.57,22.54 36.16,22.95 26,22.95 23.2,25.76 LS1.1
SPI_CS
  Top 0.178: IC3.28 31.29,21.71 31.29,20.31 24.6,13.62 24.6,9.41 22.87,7.68 JP2.2
SPI_MISO
  Top 0.178: IC3.31 35.74,21.71 35.74,19.81 33.1,17.17 33.1,12.79 27.98,7.68 JP2.6
SPI_MOSI
  Top 0.178: IC3.29 32.77,21.71 32.77,21.3 25.43,13.95 25.43,7.68 JP2.4
USB_D+
  Top 0.305: J1.3 30.05,52.74 R10.2
USB_D-
  Top 0.305: J1.2 30.7,52.12 R11.2
V_3.3  (via drill 0.35)
  Top 0.254: IC3.2 50.7,39.33 50.7,39.8 | 49.48,41.86 R8.2 49.53,41.77 49.53,40.95 50.6,39.87 IC3.2 | 34.51,48.37 34.51,48.95 35.17,49.61 C1.1 | 34.51,48.37 34.51,47.38 LED2.A | v23.53,47.05 23.03,46.56 23.03,45.57 23.77,44.83 23.77,37.56 PS1.5 | v33.35,48.37 34.51,48.37 | IC1.2 23.77,13.79 23.77,12.63 IC1.1 23.77,12.46 v23.77,9.49 | v21.13,6.19 19.4,7.92 R1.2 | 31.62,3.96 31.62,2.06 R7.2 | 31.62,3.96 30.54,5.04 JP2.7 | 40.2,45.73 39.29,44.83 39.29,44.41 LED3.A | 40.2,45.73 40.2,48.21 38.72,49.7 37.73,49.7 C5.1 37.97,49.61 v37.97,48.54 | 48.54,36.82 48.54,20.8 46.48,18.74 R9.2 47.13,17.98 44.28,15.13 44.28,12.82 36.98,5.53 36.98,5.04 35.99,4.04 31.7,4.04 31.62,3.96 | 48.54,36.82 50.85,39.13 IC3.2 | 40.2,45.73 40.28,45.65 40.62,45.65 45.57,40.7 45.57,38.3 46.97,36.9 48.46,36.9 48.54,36.82
  Bottom 0.254: 23.53,48.37 23.53,49.45 22.62,50.35 R6.2 | 23.53,48.37 v23.53,47.05 | 23.53,48.37 v33.35,48.37 33.43,48.46 37.89,48.46 v37.97,48.54 | 23.94,6.19 29.39,6.19 30.46,5.12 JP2.7 | 23.94,6.19 v21.13,6.19 | v23.77,9.49 23.77,8.26 23.94,8.09 23.94,6.19
V_BAT  (via drill 0.35)
  Top 0.254: JP1.1 17.83,14.03 14.12,10.32 CN4.4
  Bottom 0.254: 10.15,42.43 C3.1 10.07,42.35 | IC2.14 14.45,44.91 14.03,44.91 IC2.15 13.87,44.91 13.7,44.91 13.4,45.21 | 13.4,45.21 13.04,45.57 13.04,45.81 IC2.16 | 13.4,45.21 v13.11,44.91 12.63,44.91 10.15,42.43 | JP2.9 31.95,5.12 30.46,6.6 27.49,6.6 26.5,7.59 26.5,8.09 20.55,14.03 17.91,14.03 JP1.1 17.91,14.12 17.91,16.92 9,25.84 9,41.27 10.02,42.3 10.15,42.43
VBAT_OUT  (via drill 0.35)
  Top 0.254: PS1.3 21.05,35.66 21.21,35.66 21.71,36.16 21.71,37.06 21.25,37.53 PS1.1 20.57,37.93 20.57,37.97 17.02,37.97 12.45,42.55 12.45,43.81 | v12.57,49.91 12.45,49.78 12.45,44.07 12.45,43.81 | v12.46,43.8 12.45,43.81
  Bottom 0.254: IC2.1 13.36,49.46 | IC2.20 12.96,49.06 13.36,49.46 | 13.36,49.46 12.91,49.91 v12.57,49.91 | v12.46,43.8 12.45,43.79 C4.1
VCC  (via drill 0.35)
  Top 0.254: 32.03,53.66 31.37,54.32 31.37,54.57 J1.1 | 32.03,53.66 33.1,52.58 33.1,52.01 LED1.A | v31.86,53.49 32.03,53.66
  Bottom 0.254: 14.48,48.87 IC2.2 14.39,48.93 14.39,49.38 14.2,49.57 14.2,50.24 13.16,51.28 13.16,53.57 | IC2.4 15.44,48.87 15.44,49.38 15.67,49.61 15.67,53.87 16.15,54.36 | C2.1 9.25,46.23 9.33,46.31 12.88,46.31 IC2.17 12.96,46.39 12.96,46.81 IC2.18 12.96,46.97 12.96,47.3 IC2.19 12.88,47.38 12.46,47.38 12.22,47.63 12.22,48.13 11.89,48.46 11.89,52.3 13.16,53.57 | 44.91,41.19 35.99,32.28 35.99,17.75 JP5.4 | 44.91,41.19 44.91,45.4 44.74,45.57 | 13.16,53.57 13.95,54.36 16.15,54.36 | 16.15,54.36 31,54.36 v31.86,53.49 31.95,53.41 42.8,53.41 48.26,47.95 48.26,44.55 44.91,41.19

### Text on the board
tNames: PROG | SC / MOSI / MISO / SCLK / GND / IO_3 / IO_4 | GND / SCL / SDA / 3.3v / V_bat / IO_1 / IO_2 | Em 2+ / Em 2- / Em 1+ / Em 1- | KE8TJE / KC3RXZ | Bat- / Bat+ / Ext sw / Ext sw | Vcc / Tx / Rx / GND | RESET
bNames: WVUER / Jan - 2023 | Astraeus v1.1